# Altium schematic sheet main.SchDoc
size A4
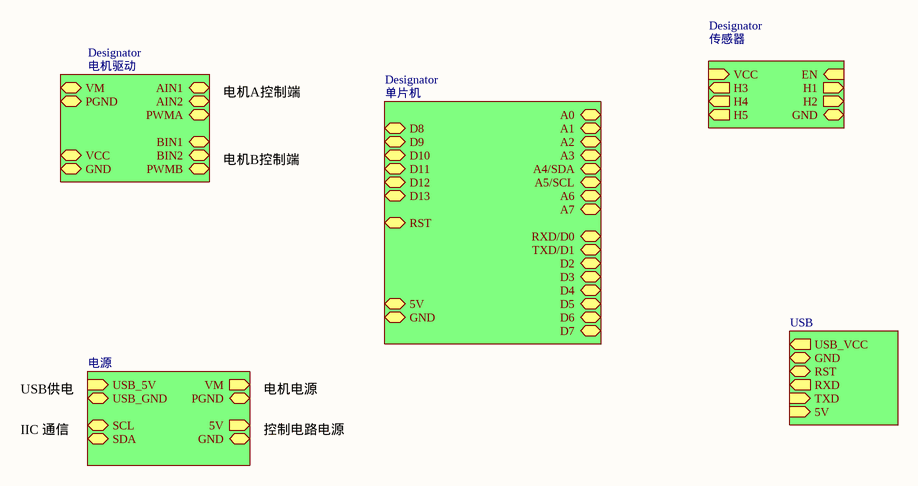
[diagram p0: main.SchDoc]

## Sub-sheets
Designator = 电机驱动: AIN1, AIN2, PWMA, BIN1, BIN2, PWMB, VCC, VM, GND, PGND
Designator = 单片机: A6, A7, A0, A1, A2, A3, A4/SDA, A5/SCL, RXD/D0, TXD/D1, D2, D3, D4, D5, D6, D7, D8, D9, D10, D11, D12, D13, 5V, GND, RST
Designator = 传感器: H1 (out), H2 (out), H3 (out), H4 (out), H5 (out), VCC (in), GND, EN (in)
Designator = USB: TXD (in), RXD (out), RST, GND, USB_VCC (out), 5V (in)
Designator = 电源: GND, VM (out), 5V (out), PGND, USB_5V (in), USB_GND, SCL, SDA

## Notes on the sheet
- 电机A控制端
- 电机B控制端
- IIC 通信
- USB供电
- 电机电源
- 控制电路电源